# EAGLE design v01 (EAGLE 7.2.0)
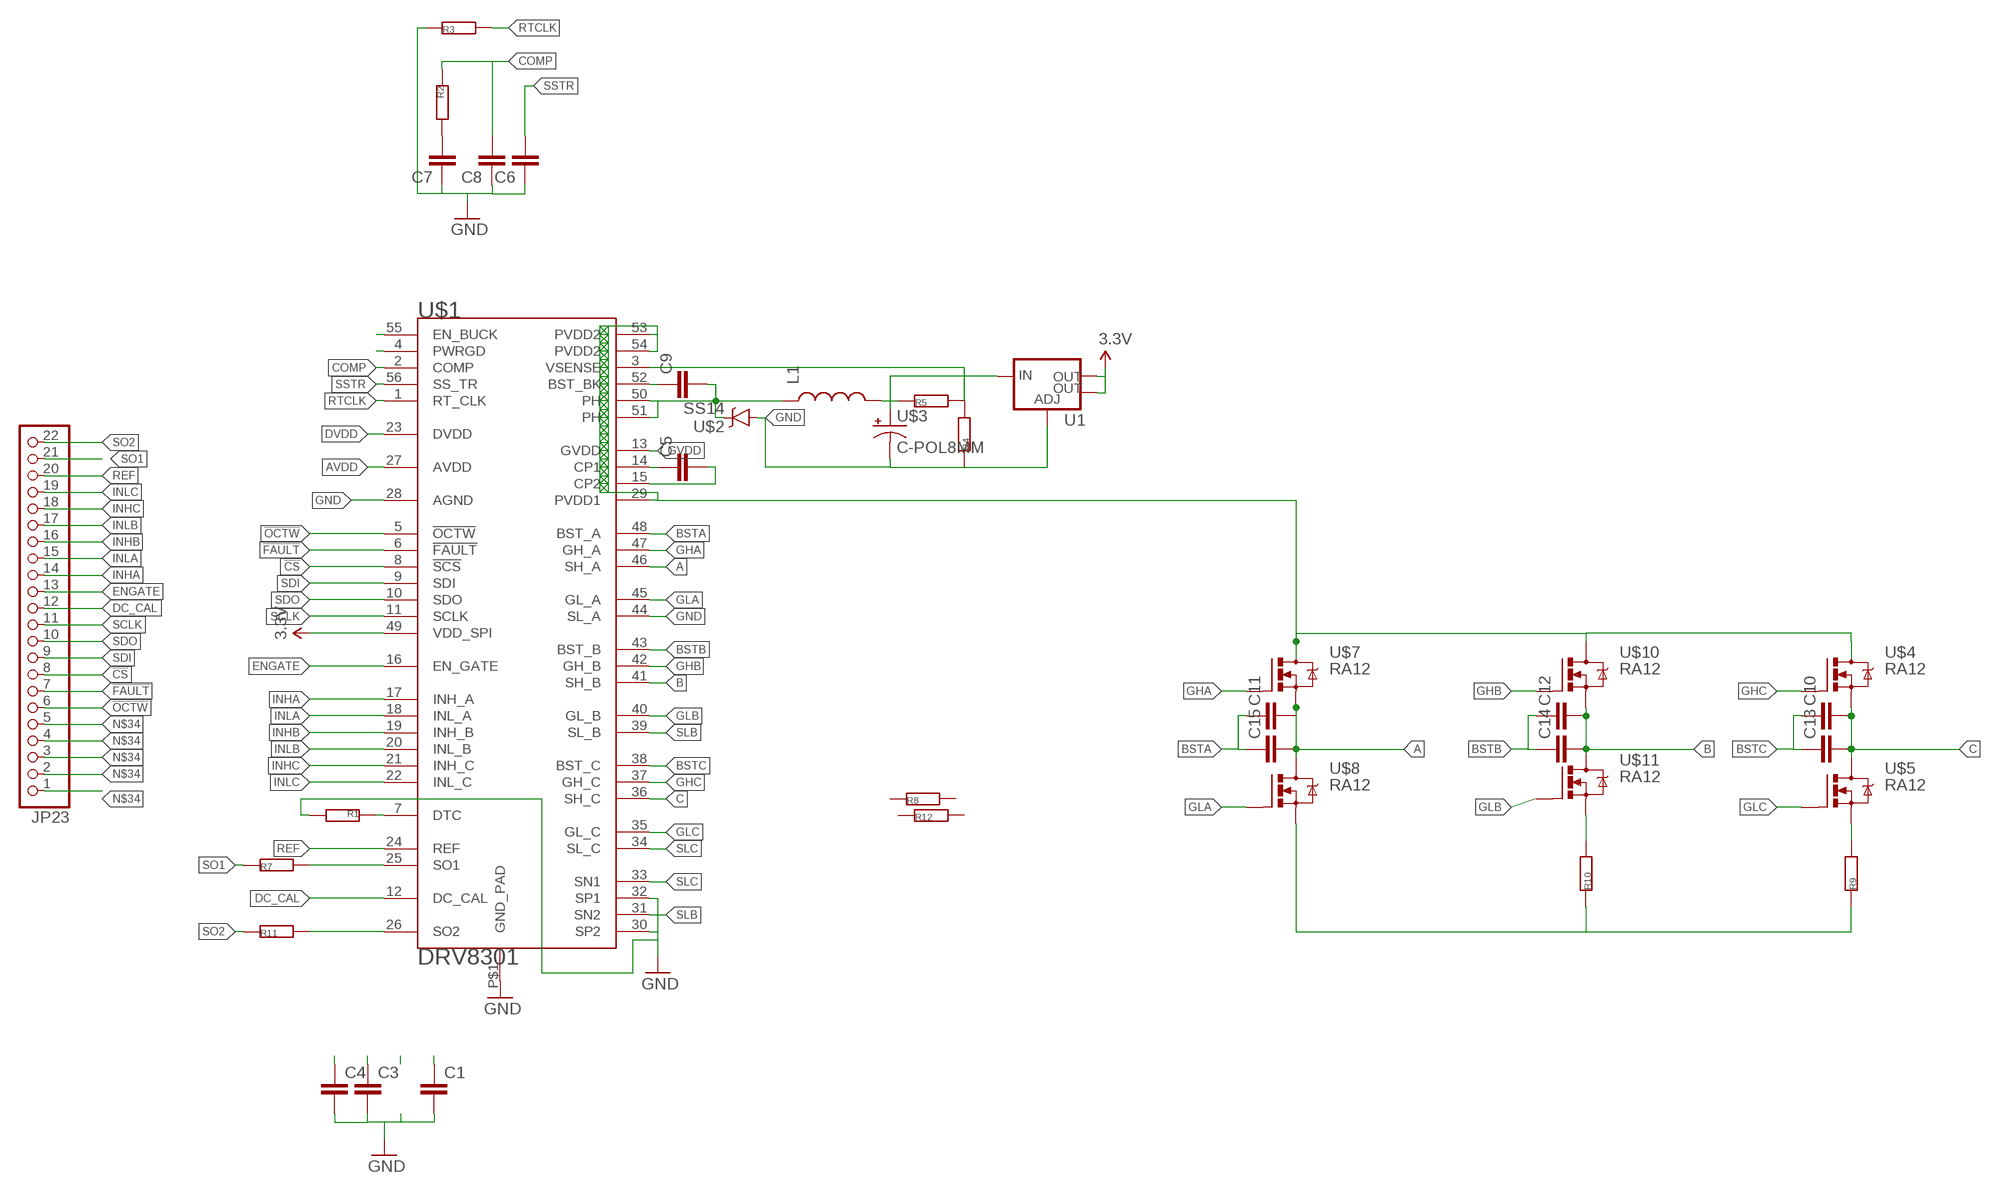
[diagram p0: schematic, sheet 1]

## Parts
C1  CC0805  [C0805]
C3  CC0805  [C0805]
C4  CC0805  [C0805]
C5  CC0603  [C0603]
C6  CC0805  [C0805]
C7  CC0805  [C0805]
C8  CC0805  [C0805]
C9  CC0603  [C0603]
C10  CC0805  [C0805]
C11  CC0805  [C0805]
C12  CC0805  [C0805]
C13  CC0805  [C0805]
C14  CC0805  [C0805]
C15  CC0805  [C0805]
JP23  PINHD-1X22  [1X22]
L1  INDUCTORDR1030  [DR1030]
R1  R0603  [0603]
R2  R0603  [0603]
R3  R0603  [0603]
R4  R0603  [0603]
R5  R0603  [0603]
R7  R0603  [0603]
R8  R1206  [R1206]
R9  R2512  [R2512]
R10  R2512  [R2512]
R11  R0603  [0603]
R12  R1206  [R1206]
U1  V_REG_LM1117SOT223  [SOT223]
U$1  DRV8301  [HTSSOP56DCA]
U$2  SS14  [SMA-DIODE]
U$3  C-POL8MM  [PCAP8]
U$4  RA12  [POWERPAK_SO8]
U$5  RA12  [POWERPAK_SO8]
U$7  RA12  [POWERPAK_SO8]
U$8  RA12  [POWERPAK_SO8]
U$10  RA12  [POWERPAK_SO8]
U$11  RA12  [POWERPAK_SO8]

## Nets
3.3V: U1.2(OUT) U1.4(OUT) U$1.49(VDD_SPI)
5V: L1.2 R5.1 U1.3(IN) U$3.P$1(+)
!CS: JP23.8 U$1.8(!SCS)
!FAULT: JP23.7 U$1.6(!FAULT)
!OCTW: JP23.6 U$1.5(!OCTW)
A: C11.2 C15.2 U$1.46(SH_A) U$7.1(S) U$7.2(S) U$7.3(S) U$8.5(D) U$8.6(D) U$8.7(D) U$8.8(D)
AVDD: C4.1 U$1.27(AVDD)
B: C12.2 C14.2 U$1.41(SH_B) U$10.1(S) U$10.2(S) U$10.3(S) U$11.5(D) U$11.6(D) U$11.7(D) U$11.8(D)
BSTA: C11.1 C15.1 U$1.48(BST_A)
BSTB: C12.1 C14.1 U$1.43(BST_B)
BSTC: C10.1 C13.1 U$1.38(BST_C)
C: C10.2 C13.2 U$1.36(SH_C) U$4.1(S) U$4.2(S) U$4.3(S) U$5.5(D) U$5.6(D) U$5.7(D) U$5.8(D)
COMP: C8.2 R2.1 U$1.2(COMP)
DC_CAL: JP23.12 U$1.12(DC_CAL)
DVDD: C3.1 U$1.23(DVDD)
ENGATE: JP23.13 U$1.16(EN_GATE)
GHA: U$1.47(GH_A) U$7.4(G)
GHB: U$1.42(GH_B) U$10.4(G)
GHC: U$1.37(GH_C) U$4.4(G)
GLA: U$1.45(GL_A) U$8.4(G)
GLB: U$1.40(GL_B) U$11.4(G)
GLC: U$1.35(GL_C) U$5.4(G)
GND: C1.2 C3.2 C4.2 C6.1 C7.1 C8.1 R1.2 R3.1 R4.1 R9.P$1 R10.P$1 U1.1(ADJ) U$1.28(AGND) U$1.30(SP2) U$1.32(SP1) U$1.44(SL_A) U$1.P$1(GND_PAD) U$2.A U$3.P$2(-) U$8.1(S) U$8.2(S) U$8.3(S)
GVDD: C1.1 U$1.13(GVDD)
INHA: JP23.14 U$1.17(INH_A)
INHB: JP23.16 U$1.19(INH_B)
INHC: JP23.18 U$1.21(INH_C)
INLA: JP23.15 U$1.18(INL_A)
INLB: JP23.17 U$1.20(INL_B)
INLC: JP23.19 U$1.22(INL_C)
N$1: C9.2 L1.1 U$1.50(PH) U$1.51(PH) U$2.C
N$19: R7.2 U$1.25(SO1)
N$21: R11.2 U$1.26(SO2)
N$22: C5.1 U$1.14(CP1)
N$23: C5.2 U$1.15(CP2)
N$25: R1.1 U$1.7(DTC)
N$27: U$1.4(PWRGD)
N$28: C7.2 R2.2
N$29: C9.1 U$1.52(BST_BK)
N$32: R4.2 R5.2 U$1.3(VSENSE)
N$34: JP23.1 JP23.2 JP23.3 JP23.4 JP23.5
N$35: U$1.55(EN_BUCK)
REF: JP23.20 U$1.24(REF)
RTCLK: R3.2 U$1.1(RT_CLK)
SCLK: JP23.11 U$1.11(SCLK)
SDI: JP23.9 U$1.9(SDI)
SDO: JP23.10 U$1.10(SDO)
SLB: R10.P$2 U$1.31(SN2) U$1.39(SL_B) U$11.1(S) U$11.2(S) U$11.3(S)
SLC: R9.P$2 U$1.33(SN1) U$1.34(SL_C) U$5.1(S) U$5.2(S) U$5.3(S)
SO1: JP23.21 R7.1
SO2: JP23.22 R11.1
SSTR: C6.2 U$1.56(SS_TR)
VCC: U$1.29(PVDD1) U$1.53(PVDD2) U$1.54(PVDD2) U$4.5(D) U$4.6(D) U$4.7(D) U$4.8(D) U$7.5(D) U$7.6(D) U$7.7(D) U$7.8(D) U$10.5(D) U$10.6(D) U$10.7(D) U$10.8(D)
Unconnected: R8.1 R8.2 R12.1 R12.2

## Library data of the parts
C1 C3-C15 = CasaLibrary:C: Capacitor
JP23 = pinhead:PINHD-1X22: PIN HEADER
L1 = SparkFun-Passives:INDUCTOR: Inductors Basic Inductor/Choke - 0603 and 1206. Footprints are not proven and vary greatly between part numbers. INDUCTOR POWER 3.3UH 4.0A SMD 0.197" L x 0.197" W x 0.177" H (5.00mm x 5.00mm x 4.50mm)
R1-R5 R7-R12 = CasaLibrary:R
U1 = SparkFun-PowerIC:V_REG_LM1117: Voltage Regulator LM1117 Standard adjustable voltage regulator but in SMD form. Spark Fun Electronics SKU : COM-00595; PROD_ID: VREG-08170
U$1 = DRV8301:DRV8301
U$2 = CasaLibrary:SS14
U$3 = CasaLibrary:C-POL
U$4 U$5 U$7 U$8 U$10 U$11 = CasaLibrary:RA12

## Board
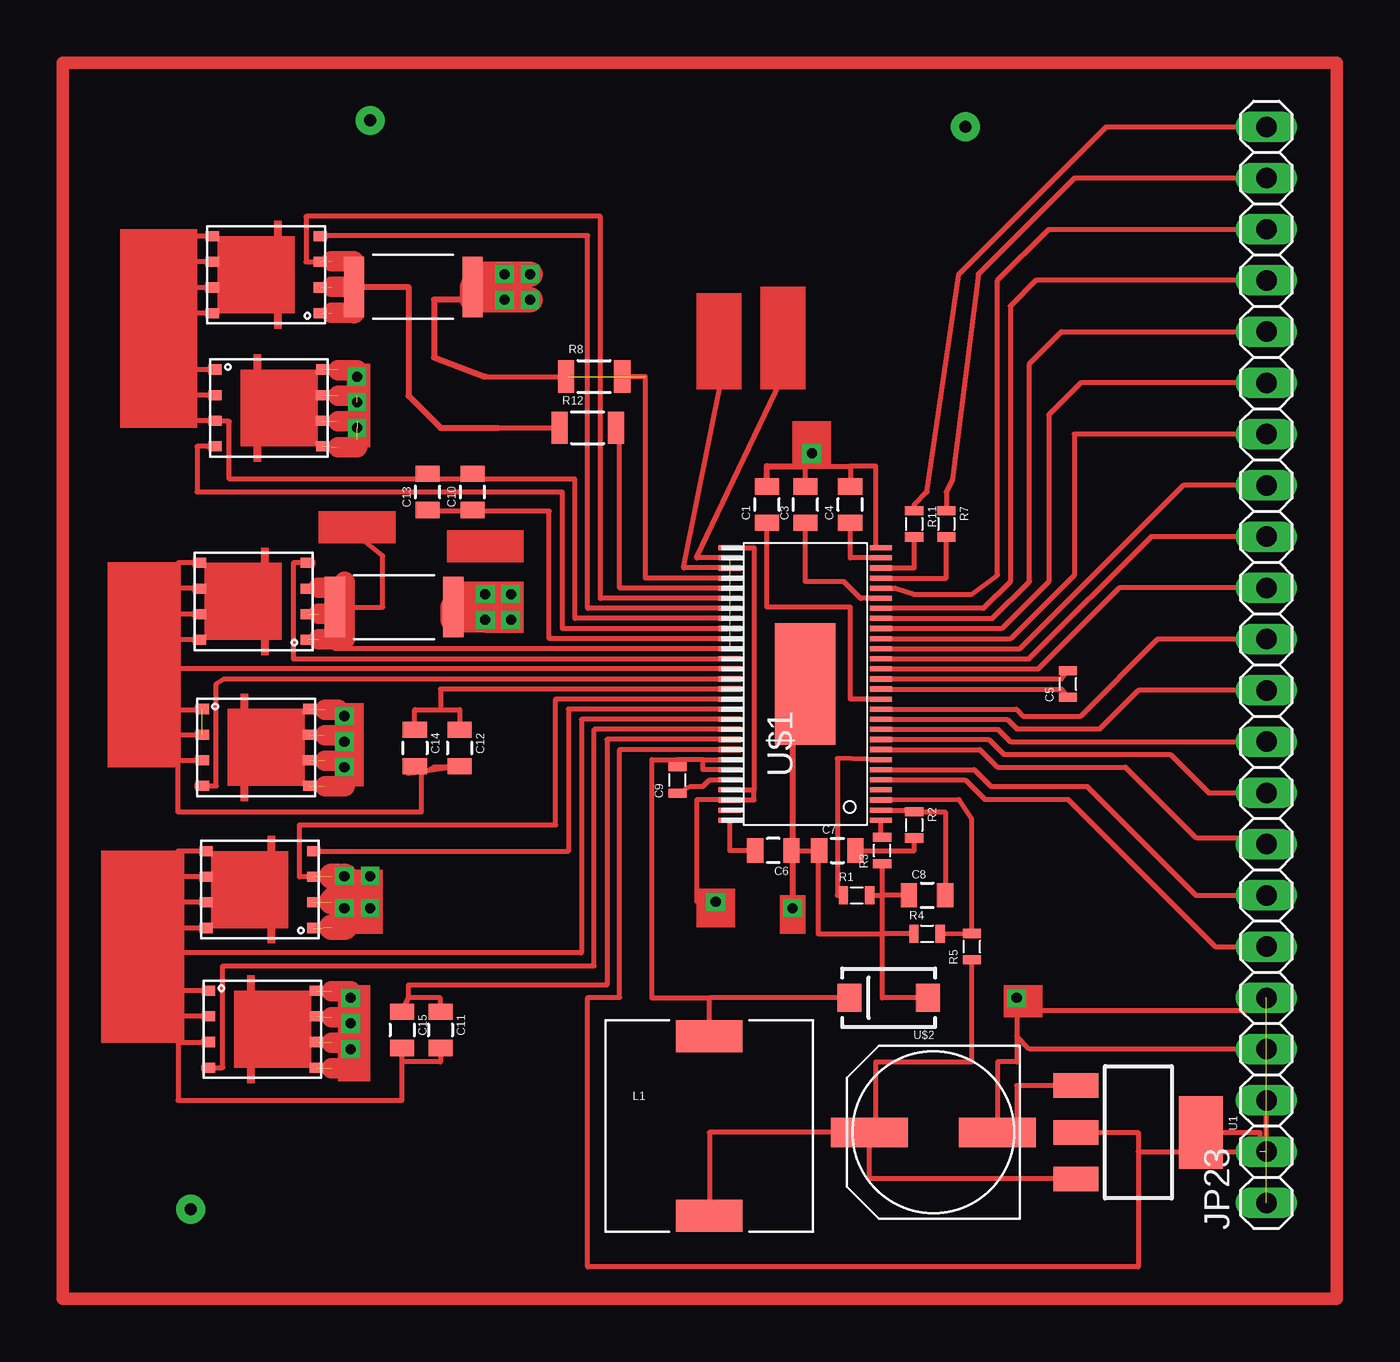
[diagram p1: board, top side]
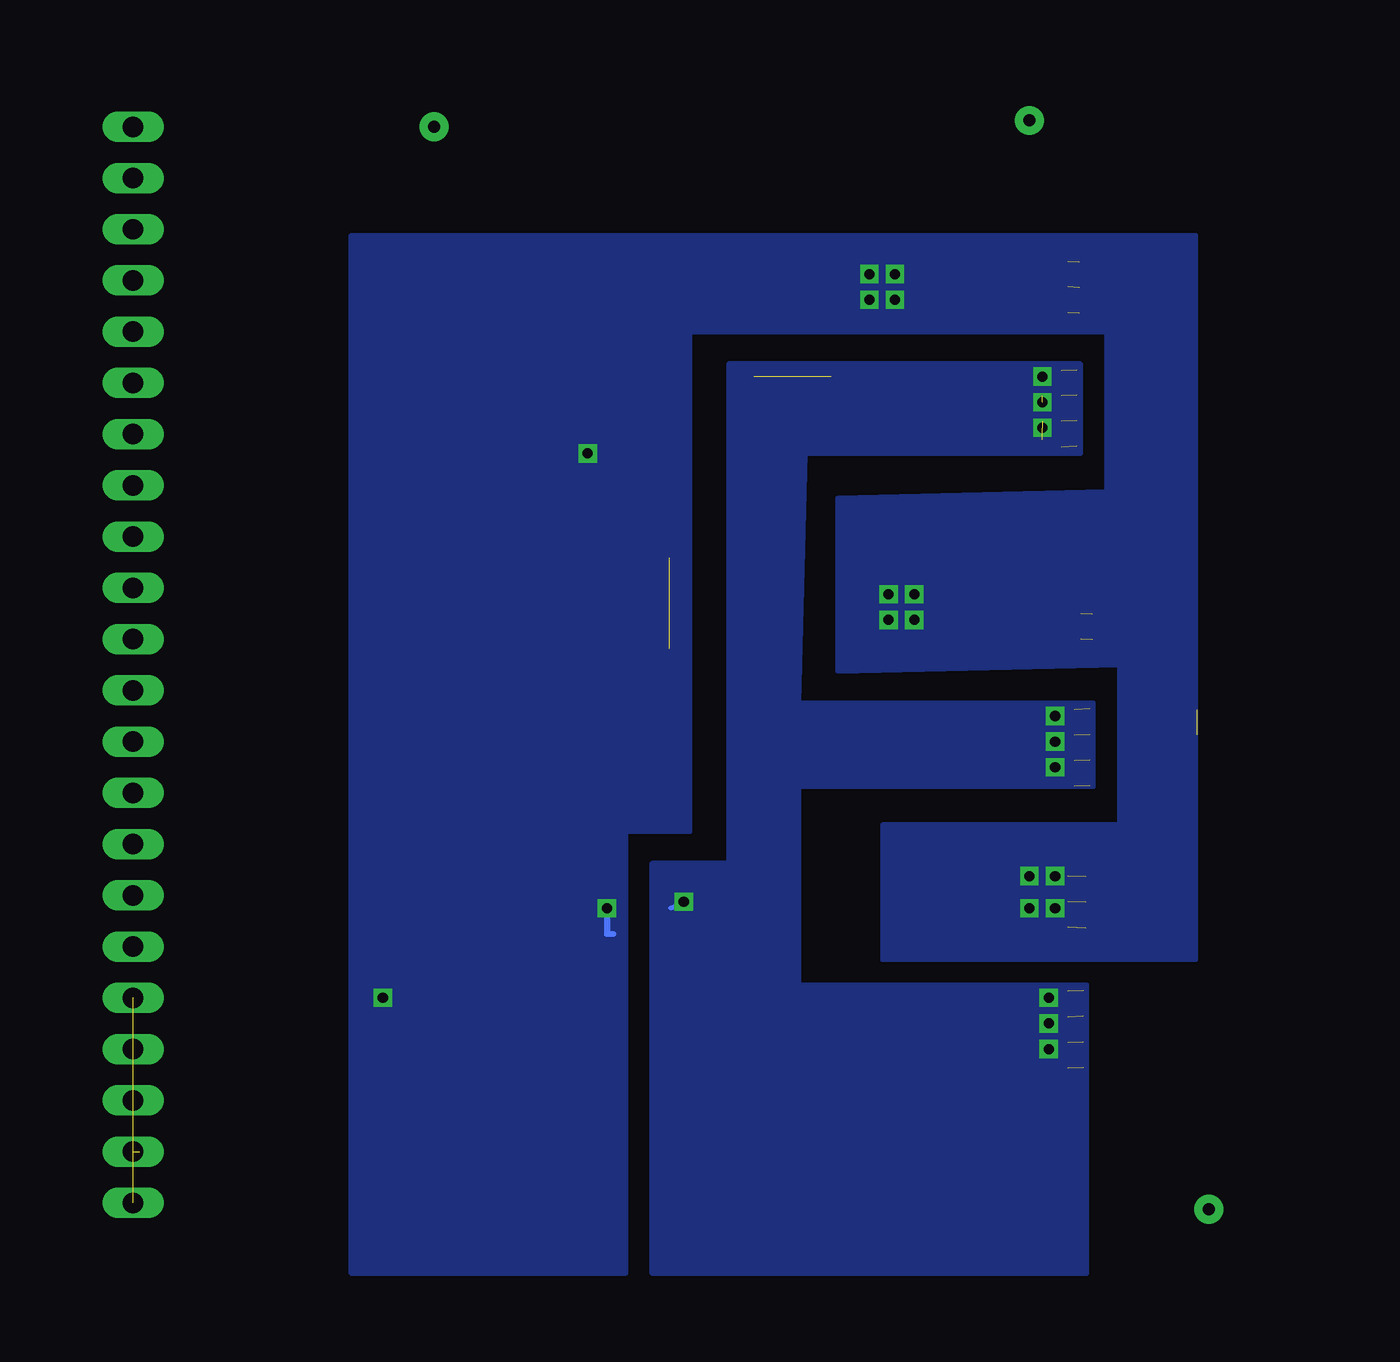
[diagram p2: board, bottom side, seen from below]

No outline drawn. Coordinates in mm, seen from the top.
Copper layers (1*16): Top 0.035mm / dielectric 1.5mm / Bottom 0.035mm
Design rules "my02": minimum track width 0.2mm, minimum drill 0.2mm, track to track 0.2mm, track to pad 0.2mm, pad to pad 0.2mm, via to via 0.2mm, smd to smd 0.2mm, copper to edge 40mil, drill to drill 8mil, minimum pad ring 10mil, minimum via ring 8mil, stop-mask expansion 4mil, vias tented up to drill 0mil, thermal gap 10mil

### Footprints (pad centres in the part's own frame; a part is rotated, then mirrored left to right if it is on the bottom)
C0805 = smd 0.8 x 1.2: 1 -0.9,0; 2 0.9,0
C0603 = smd 0.45 x 0.9: 1 -0.65,0; 2 0.65,0
1X22 = drill 1.016 long: 1 -26.67,0; 2 -24.13,0; 3 -21.59,0; 4 -19.05,0; 5 -16.51,0; 6 -13.97,0; 7 -11.43,0; 8 -8.89,0; 9 -6.35,0; 10 -3.81,0; 11 -1.27,0; 12 1.27,0; 13 3.81,0; 14 6.35,0; 15 8.89,0; 16 11.43,0; 17 13.97,0; 18 16.51,0; 19 19.05,0; 20 21.59,0; 21 24.13,0; 22 26.67,0
DR1030 = smd 3.3 x 1.6: 1 0,4.45; 2 0,-4.45
0603 = smd 0.45 x 0.9: 1 -0.65,0; 2 0.65,0
R1206 = smd 0.8 x 1.6: 1 -1.4,0; 2 1.4,0
R2512 = smd 1 x 3: P$1 0.318,-1.587; P$2 6.191,-1.587
SOT223 = smd 1.219 x 2.235: 1 -2.311,-3.099; 2 0,-3.099; 3 2.311,-3.099 | smd 3.6 x 2.2: 4 0,3.099
HTSSOP56DCA = smd 0.254 x 1.1: 1 -6.75,-3.75; 2 -6.25,-3.75; 3 -5.75,-3.75; 4 -5.25,-3.75; 5 -4.75,-3.75; 6 -4.25,-3.75; 7 -3.75,-3.75; 8 -3.25,-3.75; 9 -2.75,-3.75; 10 -2.25,-3.75; 11 -1.75,-3.75; 12 -1.25,-3.75; 13 -0.75,-3.75; 14 -0.25,-3.75; 15 0.25,-3.75; 16 0.75,-3.75; 17 1.25,-3.75; 18 1.75,-3.75; 19 2.25,-3.75; 20 2.75,-3.75; 21 3.25,-3.75; 22 3.75,-3.75; 23 4.25,-3.75; 24 4.75,-3.75; 25 5.25,-3.75; 26 5.75,-3.75; 27 6.25,-3.75; 28 6.75,-3.75; 29 6.75,3.75; 30 6.25,3.75; 31 5.75,3.75; 32 5.25,3.75; 33 4.75,3.75; 34 4.25,3.75; 35 3.75,3.75; 36 3.25,3.75; 37 2.75,3.75; 38 2.25,3.75; 39 1.75,3.75; 40 1.25,3.75; 41 0.75,3.75; 42 0.25,3.75; 43 -0.25,3.75; 44 -0.75,3.75; 45 -1.25,3.75; 46 -1.75,3.75; 47 -2.25,3.75; 48 -2.75,3.75; 49 -3.25,3.75; 50 -3.75,3.75; 51 -4.25,3.75; 52 -4.75,3.75; 53 -5.25,3.75; 54 -5.75,3.75; 55 -6.25,3.75; 56 -6.75,3.75 | smd 6 x 3: P$1 0,0
SMA-DIODE = smd 1.2 x 1.4: A -1.95,0; C 1.95,0
PCAP8 = smd 3.8 x 1.46: P$1 -3.175,0; P$2 3.175,0
POWERPAK_SO8 = smd 0.66 x 0.5: 1 -2.603,1.937; 2 -2.603,0.667; 3 -2.603,-0.603; 4 -2.603,-1.873; 5 2.731,-1.873; 6 2.731,-0.603; 7 2.731,0.667; 8 2.731,1.937

### Placement (x,y rotation side)
C1  30.16,32.38 90 top
C3  32.07,32.38 90 top
C4  34.29,32.38 90 top
C5  45.09,23.5 90 top
C6  30.48,15.24 180 top
C7  33.66,15.24 0 top
C8  38.1,13.02 0 top
C9  25.72,18.73 90 top
C10  15.56,33.02 90 top
C11  13.97,6.35 270 top
C12  14.92,20.32 270 top
C13  13.34,33.02 90 top
C14  12.7,20.32 270 top
C15  12.06,6.35 270 top
JP23  54.93,24.45 90 top
L1  27.3,1.59 0 top
R1  34.61,13.02 0 top
R2  37.47,16.51 270 top
R3  35.88,15.24 90 top
R4  38.1,11.11 0 top
R5  40.32,10.48 90 top
R7  39.05,31.43 270 top
R8  21.59,38.73 0 top
R9  15.88,41.59 180 top
R10  14.92,25.72 180 top
R11  37.47,31.43 270 top
R12  21.27,36.2 0 top
U1  48.58,1.27 270 top
U$1  32.07,23.5 90 top
U$2  36.2,7.94 180 top
U$3  38.42,1.27 0 top
U$4  5.4,37.15 0 top
U$5  5.4,43.81 180 top
U$7  5.08,6.35 0 top
U$8  5.08,13.34 180 top
U$10  4.76,20.32 0 top
U$11  4.76,27.62 180 top

### Tracks (layer width: path | path; a pad name or v marks a point on that pad's centre or on a via)
3.3V  (1 unrouted)
  Top 0.254: U$1.49 22.86,20.25 22.86,7.94 21.27,7.94 21.27,-5.4 48.58,-5.4 48.58,0.32 | U1.2 48.58,1.27 48.58,0.32 | U1.4 54.61,1.27 54.61,0.32 | 48.58,0.32 54.93,0.32 54.93,2.86
5V
  Top 0.254: U$3.P$1 27.3,1.27 L1.2 | U$3.P$1 35.56,1.27 35.56,4.76 40.32,4.76 R5.1 | U1.3 35.24,-1.04 U$3.P$1
!CS
  Top 0.254: U$1.8 40.72,20.25 41.59,19.37 47.94,19.37 51.44,15.88 54.61,15.88 JP23.8
!FAULT
  Top 0.254: U$1.6 40.45,19.25 41.27,18.41 46.04,18.41 51.44,13.02 JP23.7
!OCTW
  Top 0.254: U$1.5 39.99,18.75 40.96,17.78 45.09,17.78 52.39,10.48 JP23.6
A
  Top 0.254: U$1.46 20.95,21.75 20.95,10.16 0.95,10.16 | U$8.5 0.95,15.21 0.95,13.94 | 0.95,13.94 0.95,12.67 | 0.95,12.67 0.95,11.4 | 0.95,11.4 0.95,10.16 | 0.95,10.16 0.95,8.29 | 0.95,8.29 0.95,7.02 | 0.95,7.02 0.95,5.71 | U$7.3 2.48,5.71 0.95,5.71 | U$7.2 0.95,7.02 | U$7.1 0.95,8.29 | U$8.7 0.95,12.67 | U$8.8 0.95,11.4 | U$8.6 0.95,13.94 | 0.95,5.71 0.95,2.86 12.06,2.86 12.06,4.76 | 12.06,4.76 C15.2 | C11.2 13.97,4.76 12.06,4.76
AVDD
  Top 0.254: U$1.27 34.29,29.75 C4.1
B  (1 unrouted)
  Top 0.254: U$1.41 0.95,24.25 0.95,22.23 2.16,22.23 U$10.1 | U$11.5 0.95,29.5 0.95,28.26 | 0.95,28.26 0.95,26.96 | 0.95,26.96 0.95,25.69 | 0.95,25.69 0.95,20.95 | 0.95,20.95 0.95,19.72 | 0.95,19.72 U$10.3 | U$10.2 2.16,20.95 0.95,20.95 | U$11.8 0.95,25.69 | U$11.7 0.95,26.96 | 0.95,28.26 2.03,28.26 U$11.6 | 12.38,19.05 C12.2 13.65,19.37 13.02,19.05 | C14.2 13.02,19.05 | 13.02,19.05 13.02,17.14 0.95,17.14 0.95,19.72
BSTA
  Top 0.254: U$1.48 22.23,20.75 22.23,8.57 12.38,8.57 12.38,7.94 | C11.1 13.97,7.94 12.38,7.94 | C15.1 12.38,7.94
BSTB
  Top 0.254: C14.1 12.7,22.23 13.97,22.23 | 13.97,22.23 14.92,22.23 C12.1 | U$1.43 13.97,23.25 13.97,22.23
BSTC
  Top 0.254: U$1.38 19.37,25.75 19.37,32.07 15.88,32.07 | 15.88,32.07 13.65,32.07 C13.1 | C10.1 15.88,32.07
C
  Top 0.254: U$1.36 20.64,26.75 20.64,33.66 15.24,33.66 | 0.95,37.81 0.95,36.54 U$4.3 2.79,36.51 3.49,36.51 3.49,33.66 13.65,33.66 | 0.95,41.88 0.95,43.15 | 0.95,43.15 0.95,44.42 | 0.95,44.42 0.95,45.72 2.67,45.72 U$5.5 | U$5.6 0.95,44.42 | U$4.2 0.95,37.81 | 0.95,37.81 0.95,39.08 | 0.95,39.08 0.95,41.88 | U$5.8 0.95,41.88 | U$4.1 0.95,39.08 | U$5.7 0.95,43.15 | 15.24,33.66 13.65,33.66 | C10.2 15.24,33.66 | C13.2 13.65,33.99 13.65,33.66
COMP
  Top 0.254: U$1.2 37.47,17.25 R2.1 39,17.16 C8.2
DC_CAL
  Top 0.254: U$1.12 42.52,22.25 42.86,21.91 45.72,21.91 49.53,25.72 JP23.12
DVDD
  Top 0.254: U$1.23 34.8,27.75 33.97,28.57 32.07,28.57 C3.1
ENGATE
  Top 0.254: U$1.16 43.61,24.25 47.62,28.26 JP23.13
GHA
  Top 0.254: U$1.47 21.59,21.25 21.59,9.53 3.17,9.53 3.17,4.48 U$7.4
GHB
  Top 0.254: U$10.4 2.86,18.45 2.86,23.5 3.24,23.75 U$1.42
GHC
  Top 0.254: U$1.37 20,26.25 20,33.02 1.91,33.02 1.91,35.27 U$4.4
GLA
  Top 0.254: U$1.45 20.32,22.25 20.32,15.21 U$8.4
GLB
  Top 0.254: U$11.4 6.67,29.5 6.67,24.75 U$1.40
GLC
  Top 0.254: U$1.35 21.27,27.25 21.27,45.72 8,45.72 U$5.4
GND  (via drill 0.5, 0.5 pad 0.3)  (5 unrouted)
  Top 0.254: U$1.44 19.68,22.75 19.68,16.51 6.99,16.51 6.99,13.94 U$8.3 | C6.1 31.43,15.24 | 31.43,15.24 31.43,23.5 U$1.P$1 | 31.43,15.24 C7.1 32.7,15.24 32.7,11.11 35.88,11.11 | 32.38,34.29 34.29,34.29 | 34.29,34.29 C4.2 | C3.2 32.07,34.29 | U$1.28 35.56,30.25 35.56,34.29 34.29,34.29 | U$1.32 24.13,28.75 24.13,38.73 22.86,38.73 | U$1.30 26.67,29.75 31.11,39.05 | 16.19,38.73 20.32,38.73 | R4.1 35.88,11.11 | 35.88,11.11 35.88,13.02 | 35.88,13.02 R3.1 | R1.2 35.88,13.02 | C8.1 35.88,13.02 | U$2.A 35.88,7.94 35.88,11.11 | 42.55,6.03 v42.55,7.94 43.18,7.3 54.93,7.3 | 42.55,6.03 42.55,4.76 41.59,4.76 U$3.P$2 42.55,1.27 42.55,3.58 U1.1 | 55.24,5.4 43.18,5.4 42.55,6.03
  Top 0.305: 31.43,23.5 v31.43,12.38 | v32.38,34.92 32.38,34.29 32.07,34.29 30.16,34.29 C1.2 | v18.41,43.81 15.56,42.55 13.65,42.55 13.65,39.69 16.19,38.73
  Top 1.27: 16.83,43.81 v18.41,43.81 15.88,43.81 | R9.P$1 15.56,42.55 v18.41,42.55 | v16.19,27.94 14.92,27.94 14.92,27.3 R10.P$1 14.61,26.67 v17.46,26.67 | v9.21,13.97 9.21,13.65 | 9.21,13.34 v9.21,12.38 | 8.57,11.43 9.21,11.43 v9.21,12.38 | v9.21,12.38 8.89,12.7 8.57,12.7 9.21,13.34 | 9.21,13.34 9.21,13.65 | 9.21,13.65 8.89,13.97 8.57,13.97
  Bottom 0.305: v31.43,12.38 31.43,11.11 31.11,11.11
  other vias: 17.14,43.81 17.14,42.55 17.46,27.94 16.19,26.67 10.48,12.38 10.48,13.97
  pour Bottom: 2.22,45.72 44.13,45.72 44.13,-5.71 30.48,-5.71 30.48,16.19 27.3,16.19 27.3,40.96 6.67,40.96 6.67,33.02 20,32.7 20,24.13 6.03,24.45 6.03,16.51 17.78,16.51 17.78,9.84 2.22,9.84
GVDD
  Top 0.254: U$1.13 34.29,22.75 34.29,27.3 30.16,27.3 C1.1
INHA
  Top 0.254: U$1.17 43.16,24.75 49.21,30.8 JP23.14
INHB
  Top 0.254: JP23.16 45.4,35.88 45.4,28.89 42.26,25.75 U$1.19
INHC
  Top 0.254: U$1.21 41.35,26.75 43.18,28.57 43.18,39.37 44.77,40.96 JP23.18
INLA
  Top 0.254: U$1.18 42.71,25.25 50.8,33.34 JP23.15
INLB
  Top 0.254: JP23.17 45.72,38.42 44.13,36.83 44.13,28.57 41.8,26.25 U$1.20
INLC
  Top 0.254: JP23.19 43.5,43.5 42.23,42.23 42.23,28.57 40.9,27.25 U$1.22
N$1
  Top 0.254: 27.3,7.94 24.45,7.94 24.45,19.75 25.72,19.75 | L1.1 27.3,7.94 | U$2.C 27.3,7.94 | 26.99,19.75 25.72,19.75 | 25.72,19.75 C9.2 | 26.99,19.75 U$1.50 | U$1.51 26.99,19.25 26.99,19.75
N$2
  Top 0.61: 58.42,54.29 -4.76,54.29 -4.76,-6.99 58.42,-6.99 58.42,54.29
N$3  (via drill 0.6 pad 1.42)
  other vias: 40.01,51.12
N$4  (via drill 0.6 pad 1.42)
  other vias: 10.48,51.44
N$5  (via drill 0.6 pad 1.42)
  other vias: 1.59,-2.54
N$19
  Top 0.254: R7.2 39.05,28.75 U$1.25
N$21
  Top 0.254: R11.2 37.47,29.25 U$1.26
N$22
  Top 0.254: U$1.14 44.77,23.25 C5.1
N$23
  Top 0.254: U$1.15 44.77,23.75 C5.2
N$25
  Top 0.254: U$1.7 33.66,19.8 33.66,13.02 R1.1
N$28
  Top 0.254: C7.2 37.47,15.24 R2.2
N$29
  Top 0.254: C9.1 26.35,18.41 26.99,18.41 27.32,18.75 U$1.52
N$32
  Top 0.254: U$1.3 39.69,17.78 39.69,17.75 40.32,16.79 40.32,16.51 R5.2 | R5.2 40.32,11.41 | R4.2 R5.2
N$34  (4 unrouted)
REF
  Top 0.254: U$1.24 36.52,28.25 37.47,27.94 40.32,27.94 41.59,28.89 41.59,43.5 44.13,46.04 JP23.20
RTCLK
  Top 0.254: R3.2 35.82,15.89 U$1.1
SCLK
  Top 0.254: U$1.11 42.07,21.75 42.55,21.27 46.67,21.27 48.58,23.18 JP23.11
SDI
  Top 0.254: U$1.9 41.17,20.75 41.91,20 50.16,20 52.07,18.1 JP23.9
SDO
  Top 0.254: U$1.10 41.62,21.25 42.23,20.64 JP23.10
SLB  (3 unrouted)
  Top 0.254: 8.89,25.4 8.57,28.26 7.37,28.26 U$11.3 | 8.73,28.23 R10.P$2 8.73,26.66 | U$1.39 8.73,25.25 8.73,25.69 | 9.21,25.72 9.21,27.3 11.11,27.3 11.11,29.84 9.53,31.11 | U$1.31 26.04,29.25 27.94,38.73
  Top 1.016: 8.7,25.72 8.73,25.69 8.73,26.66 | 8.73,28.23 8.7,28.26 8.57,28.26 7.94,28.26 | 8.7,25.72 7.94,25.72 | 8.73,26.96 R10.P$2 | 8.7,25.72 8.89,25.72 8.89,26.99 | 8.89,26.99 7.94,26.99 | 8.89,26.99 9.21,26.99 | 9.21,26.99 9.21,27.3 9.21,28.57 | 9.21,26.99 9.21,25.72
SLC  (4 unrouted)
  Top 0.254: U$1.34 21.91,27.75 21.91,46.67 7.3,46.67 7.3,44.42 U$5.3 | 9.68,44.42 R9.P$2 9.68,43.15 9.68,41.88 | U$1.33 22.86,28.25 22.86,35.88 | 16.83,36.2 20,36.2
  Top 0.305: 8.57,43.18 12.38,43.18 12.38,37.78 13.97,36.2 16.83,36.2
  Top 1.016: 9.68,43.15 9.65,43.18 8.57,43.18 | 9.68,44.42 9.65,44.45 8.57,44.45 | 9.68,41.88 9.65,41.91 8.57,41.91
SO1
  Top 0.254: JP23.21 45.4,48.58 40.64,43.81 39.37,33.66 39.05,33.02 R7.1
SO2
  Top 0.254: R11.1 37.47,32.38 38.1,33.02 39.69,43.81 46.99,51.12 JP23.22
SSTR
  Top 0.254: C6.2 28.32,15.24 U$1.56
VCC  (via drill 0.5)  (15 unrouted)
  Top 0.254: U$1.29 29.53,30.25 29.53,18.25 | U$1.53 29.53,18.25 | 29.53,18.25 29.53,17.75 U$1.54 26.67,17.75 26.67,12.7 v27.62,12.7
  Top 1.016: v9.21,21.91 8.89,22.23 8.26,22.23 | v9.21,20.64 8.89,20.95 8.26,20.95 | 8.26,19.68 8.89,19.68 v9.21,19.37 9.21,18.41 8.26,18.41 | v9.53,7.94 9.53,8.26 8.57,8.26 | v9.53,6.67 9.53,6.99 8.57,6.99 | 8.57,5.71 9.53,5.71 v9.53,5.4 9.53,4.45 8.57,4.45 | 9.84,35.59 9.84,35.24 8.89,35.24 | 9.84,36.54 9.84,36.51 8.89,36.51 | 8.89,37.78 9.84,37.78 9.84,39.05 8.89,39.05
  Bottom 0.254: v27.62,12.7 28.26,12.38
  other vias: 9.84,37.47 9.84,36.2 9.84,38.73
  pour Bottom: 7.94,39.37 25.4,39.37 25.4,14.61 29.21,14.61 29.21,-5.71 7.62,-5.71 7.62,8.57 21.91,8.57 21.91,18.41 7.3,18.41 7.3,22.54 21.91,22.54 21.59,34.92 7.94,34.92
(copper drawn outside any net)
  shapes: Top area x17